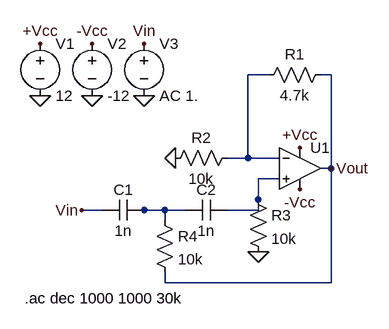
[diagram p0: schematic hpf.asc]
hpf.asc, the LTspice schematic file:
Version 4
SHEET 1 880 680
WIRE 288 224 256 224
WIRE 384 224 368 224
WIRE 256 352 256 224
WIRE 256 352 224 352
WIRE 304 352 256 352
WIRE 384 368 384 224
WIRE 384 368 368 368
WIRE 304 384 272 384
WIRE 272 416 272 384
WIRE 32 432 0 432
WIRE 96 432 80 432
WIRE 128 432 96 432
WIRE 160 432 128 432
WIRE 272 432 272 416
WIRE 272 432 224 432
WIRE 128 448 128 432
WIRE 128 544 128 528
WIRE 384 544 384 368
WIRE 384 544 128 544
FLAG 16 256 0
FLAG -64 256 0
FLAG 96 256 0
FLAG -64 176 +Vcc
FLAG 16 176 -Vcc
FLAG 96 176 Vin
FLAG 336 336 +Vcc
FLAG 336 400 -Vcc
FLAG 272 496 0
FLAG 144 352 0
FLAG 384 368 Vout
FLAG 0 432 Vin
SYMBOL OpAmps\\UniversalOpAmp 336 368 R0
SYMATTR InstName U1
SYMBOL voltage -64 160 R0
WINDOW 123 0 0 Left 0
WINDOW 39 0 0 Left 0
SYMATTR InstName V1
SYMATTR Value 12
SYMBOL voltage 16 160 R0
WINDOW 123 0 0 Left 0
WINDOW 39 0 0 Left 0
SYMATTR InstName V2
SYMATTR Value -12
SYMBOL voltage 96 160 R0
WINDOW 123 0 0 Left 0
WINDOW 39 0 0 Left 0
SYMATTR InstName V3
SYMATTR Value AC 1.
SYMBOL res 384 208 R90
WINDOW 0 0 56 VBottom 2
WINDOW 3 32 56 VTop 2
SYMATTR InstName R1
SYMATTR Value 4.7k
SYMBOL res 256 400 R0
SYMATTR InstName R3
SYMATTR Value 10k
SYMBOL cap 32 448 R270
WINDOW 0 32 32 VTop 2
WINDOW 3 0 32 VBottom 2
SYMATTR InstName C1
SYMATTR Value 1n
SYMBOL res 240 336 R90
WINDOW 0 0 56 VBottom 2
WINDOW 3 32 56 VTop 2
SYMATTR InstName R2
SYMATTR Value 10k
SYMBOL res 112 432 R0
SYMATTR InstName R4
SYMATTR Value 10k
SYMBOL cap 160 448 R270
WINDOW 0 32 32 VTop 2
WINDOW 3 0 32 VBottom 2
SYMATTR InstName C2
SYMATTR Value 1n
TEXT -88 568 Left 2 !.ac dec 1000 1000 30k

The netlist it stands for:
* hpf.asc
XU1 N002 N001 +Vcc -Vcc Vout level1 Avol=1Meg GBW=10Meg Vos=0 En=0 Enk=0 In=0 Ink=0 Rin=500Meg  ; pins In+ In- V+ V- OUT
V1 +Vcc 0 12
V2 -Vcc 0 -12
V3 Vin 0 AC 1.
R1 Vout N001 4.7k
R3 N002 0 10k
C1 Vin N003 1n
R2 N001 0 10k
R4 N003 Vout 10k
C2 N003 N002 1n
.ac dec 1000 1000 30k
.lib UniversalOpAmp1.lib
.backanno
.end